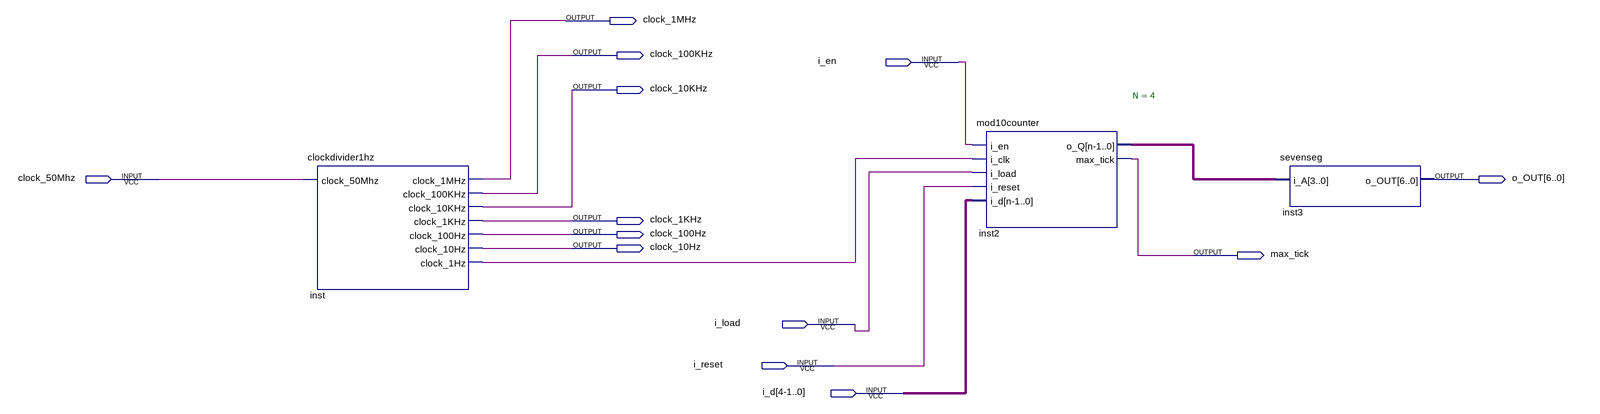
[diagram p0: schematic sheet]
// Quartus schematic mod10count.bdf as structural Verilog: 3 symbols, 13 pins
module mod10count (
  input  i_en,
  input  clock_50Mhz,
  input  i_load,
  input  i_reset,
  input  \i_d[4-1..0] ,
  output clock_1MHz,
  output clock_100KHz,
  output clock_10KHz,
  output [6:0] o_OUT,
  output clock_1KHz,
  output clock_100Hz,
  output clock_10Hz,
  output max_tick
);

  wire inst_clock_1hz;
  wire [3:0] inst2_o_q, undriven;

  clockdivider1hz inst (
    .clock_50Mhz(clock_50Mhz), .clock_1MHz(clock_1MHz), .clock_100KHz(clock_100KHz),
    .clock_10KHz(clock_10KHz), .clock_1KHz(clock_1KHz), .clock_100Hz(clock_100Hz), .clock_10Hz(clock_10Hz),
    .clock_1Hz(inst_clock_1hz));
  mod10counter #(.N(4)) inst2 (
    .i_en(i_en), .i_clk(inst_clock_1hz), .i_load(i_load), .i_reset(i_reset), .i_d(undriven), .o_Q(inst2_o_q),
    .max_tick(max_tick));
  sevenseg inst3 (.i_A(inst2_o_q), .o_OUT(o_OUT));
endmodule
